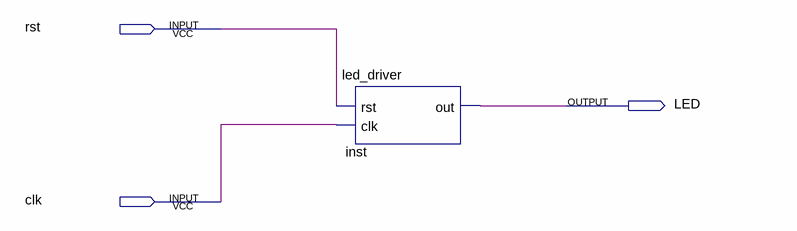
[diagram p0: schematic sheet]
// Quartus schematic led_tester.bdf as structural Verilog: 1 symbols, 3 pins
module led_tester (
  input  rst,
  input  clk,
  output LED
);

  led_driver inst (.rst(rst), .clk(clk), .out(LED));
endmodule
